# Altium schematic sheet MDBT50Q-1M_Footprint Model.SchDoc
size A4; SheetNumber: 2; SheetTotal: 2
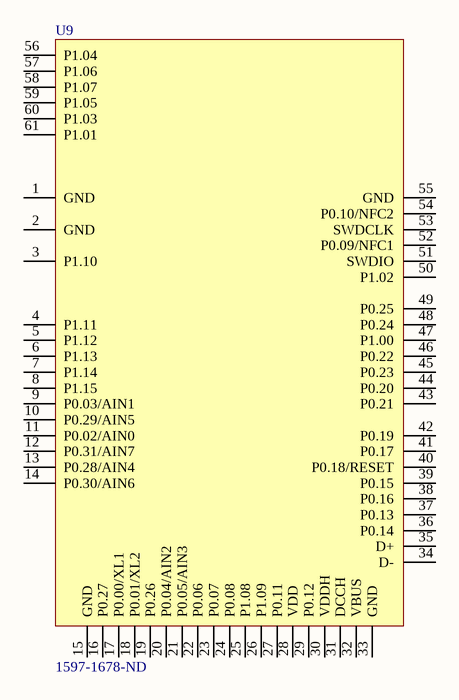
[diagram p0: MDBT50Q-1M_Footprint Model.SchDoc]

## Parts
U9  Supplier Part Number 1: 1597-1678-ND  [IC_MDBT50Q-1M_SMD]  (hidden comment: IC_MDBT50Q-1M_SMD)

## Nets

Not connected (* = marked no-connect by the designer): U9 1(GND) 2(GND) 3(P1.10) 4(P1.11) 5(P1.12) 6(P1.13) 7(P1.14) 8(P1.15) 9(P0.03/AIN1) 10(P0.29/AIN5) 11(P0.02/AIN0) 12(P0.31/AIN7) 13(P0.28/AIN4) 14(P0.30/AIN6) 15(GND) 16(P0.27) 17(P0.00/XL1) 18(P0.01/XL2) 19(P0.26) 20(P0.04/AIN2) 21(P0.05/AIN3) 22(P0.06) 23(P0.07) 24(P0.08) 25(P1.08) 26(P1.09) 27(P0.11) 28(VDD) 29(P0.12) 30(VDDH) 31(DCCH) 32(VBUS) 33(GND) 34(D-) 35(D+) 36(P0.14) 37(P0.13) 38(P0.16) 39(P0.15) 40(P0.18/RESET) 41(P0.17) 42(P0.19) 43(P0.21) 44(P0.20) 45(P0.23) 46(P0.22) 47(P1.00) 48(P0.24) 49(P0.25) 50(P1.02) 51(SWDIO) 52(P0.09/NFC1) 53(SWDCLK) 54(P0.10/NFC2) 55(GND) 56(P1.04) 57(P1.06) 58(P1.07) 59(P1.05) 60(P1.03) 61(P1.01)

## Library data of the parts
U9 = IC_MDBT50Q-1M_SMD: MDBT50Q-1M NRF52840 BASED BLE MO; Manufacturer: Seeed Studio; Manufacturer Part Number: 113990582; Interface: I2C,SPI,USB,ADC,GPIO,UART; Frequency: 2.5GHz; Data Rate: 2Mbps; Sensitivity: -103dBm; Memory Size: 256KB; Current - Receiving: 32.7mA; Current - Transmitting: 11.1mA; Supplier 1: Digi-Key; RoHS: No; Category: RF Receivers, Transceivers; Pricing 1: 1=10.10000 (USD); Mount: Surface Mount; Case/Package: SMD/SMT; Min Operating Temperature: -40°C; Max Operating Temperature: 85°C; ComponentLink1URL: http://www.raytac.com/download/index.php?index_id=24&src-supplier=Digi-Key; ComponentLink1Description: http://www.raytac.com/download/index.php?index_id=24&src-supplier=Digi-Key